# EAGLE design TL2285_labpcb (EAGLE 7.1.0)
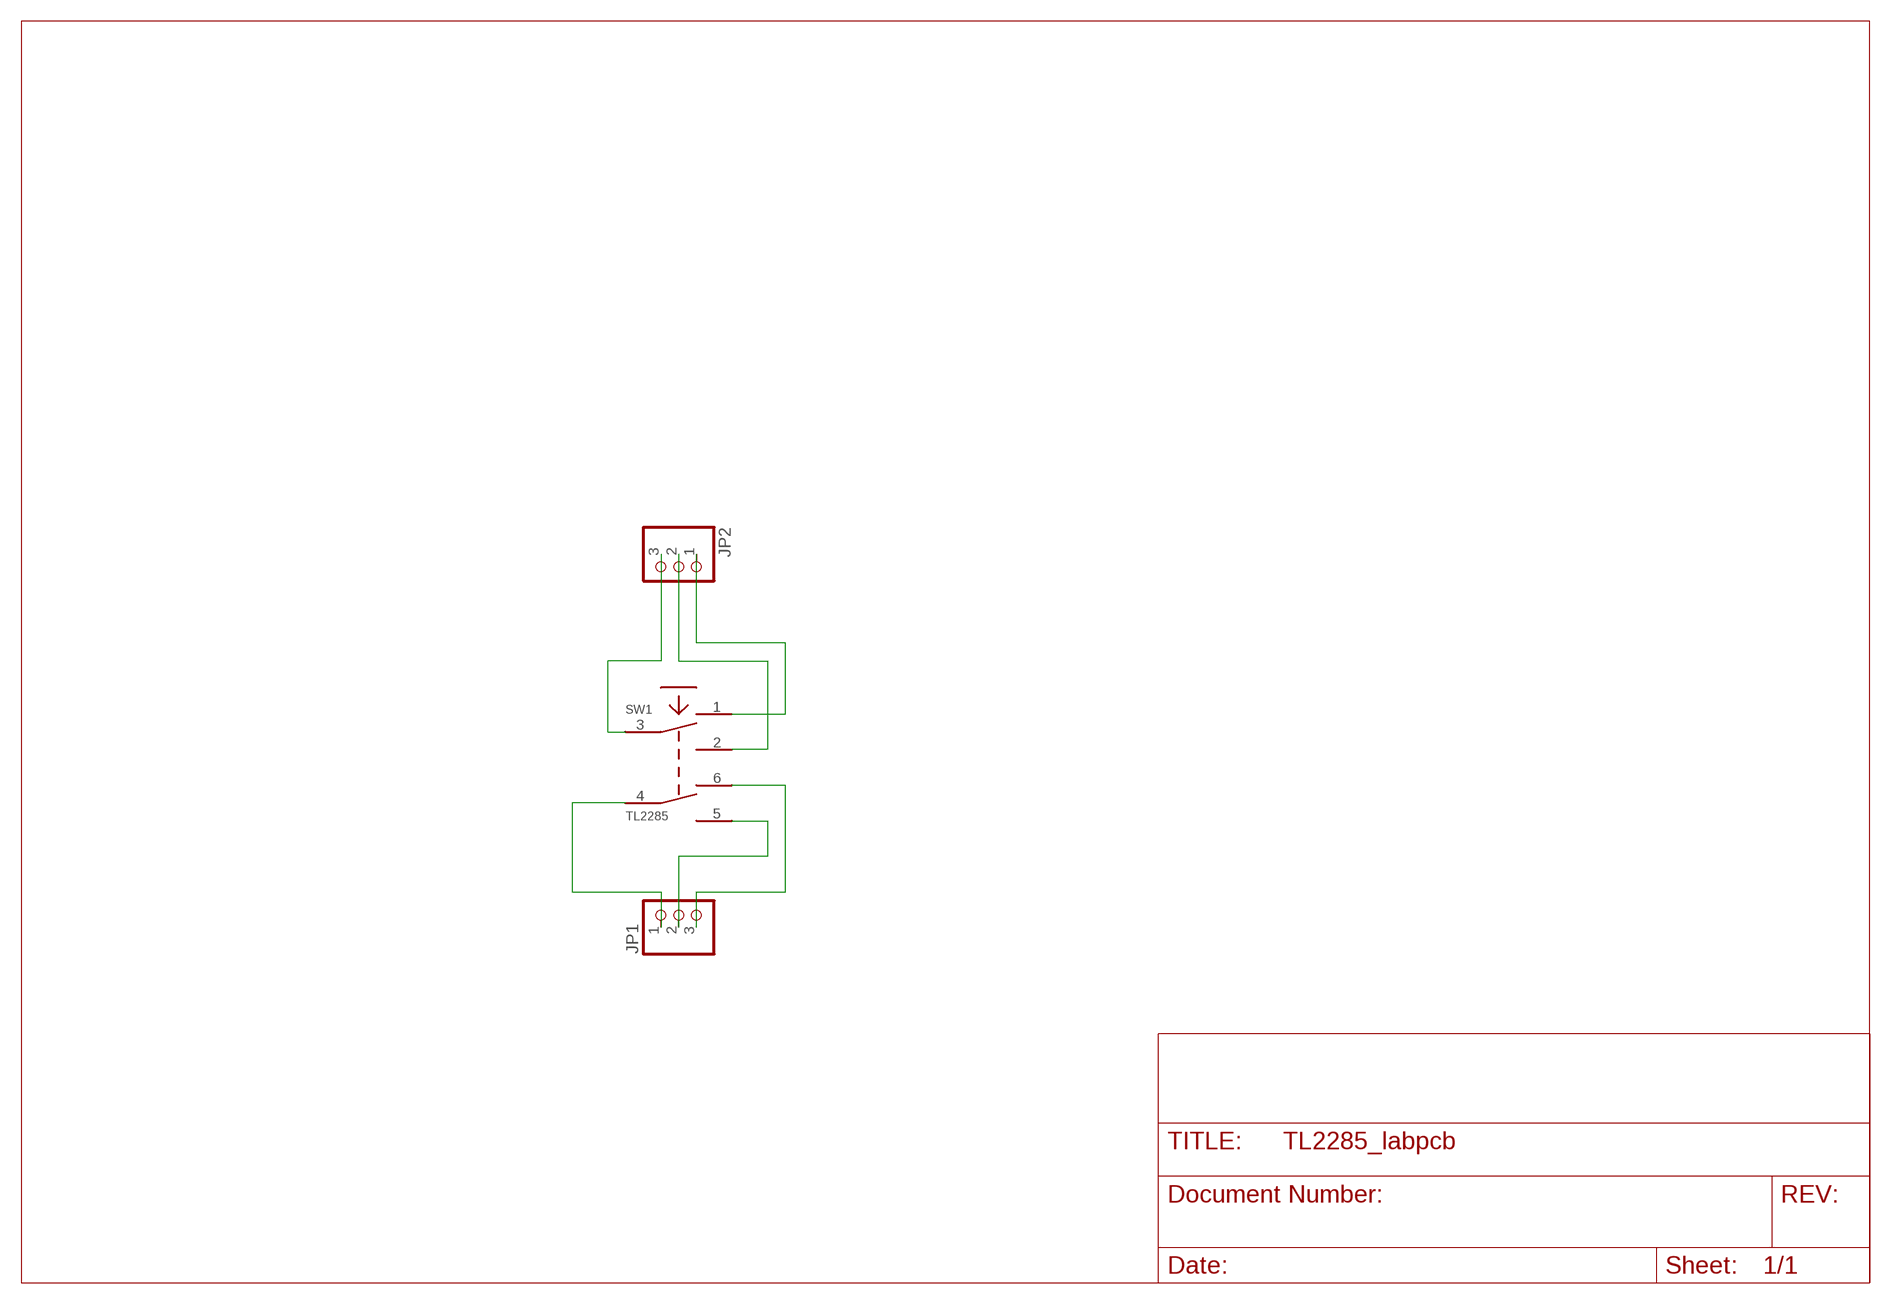
[diagram p0: schematic, sheet 1]

## Parts
JP1  PINHD-1X3  [1X03]
JP2  PINHD-1X3  [1X03]
SW1  TL2285  [TL2285_PCB]

## Nets
N$1: JP1.1 SW1.4
N$2: JP1.2 SW1.5
N$3: JP1.3 SW1.6
N$5: JP2.3 SW1.3
N$6: JP2.1 SW1.1
N$7: JP2.2 SW1.2

## Library data of the parts
JP1 JP2 = pinhead:PINHD-1X3: PIN HEADER
SW1 = lb_devs:TL2285: E-Switch TL2285 (PCB switch)

## Board
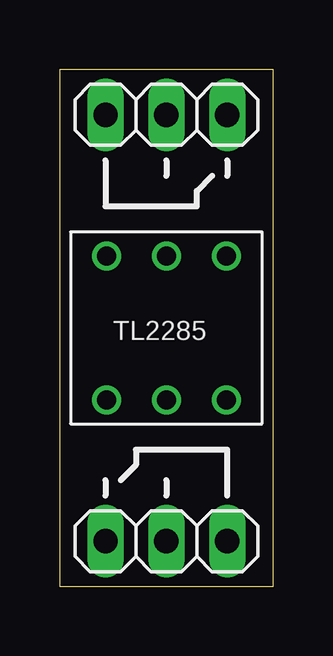
[diagram p1: board, top side]
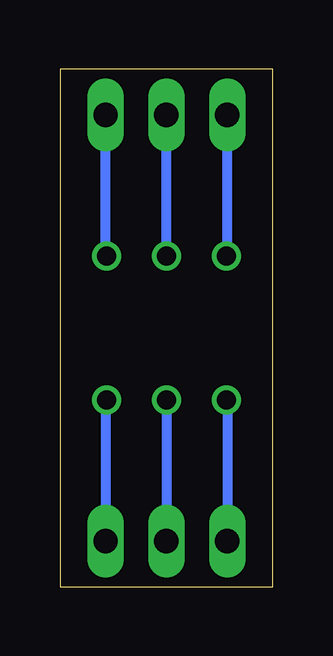
[diagram p2: board, bottom side, seen from below]

Size 8.89 x 21.59 mm. Coordinates in mm from the lower left corner, seen from the top.
Outline: 0,0 0,21.59 8.89,21.59 8.89,0 0,0
Copper layers (1*16): Top 0.0356mm / dielectric 1.5011mm / Bottom 0.0356mm
Design rules "LaenPCBOrder": minimum track width 6mil, minimum drill 13mil, track to track 6mil, track to pad 6mil, pad to pad 6mil, via to via 6mil, smd to smd 6mil, copper to edge 15mil, drill to drill 6mil, minimum pad ring 7mil, minimum via ring 7mil, stop-mask expansion 3mil, vias tented up to drill 0mil, thermal gap 10mil

### Footprints (pad centres in the part's own frame; a part is rotated, then mirrored left to right if it is on the bottom)
1X03 = drill 1.016 long: 1 -2.54,0; 2 0,0; 3 2.54,0
TL2285_PCB = drill 0.8: 1 -2.5,-3; 2 0,-3; 3 2.5,-3; 4 -2.5,3; 5 0,3; 6 2.5,3

### Placement (x,y rotation side)
JP1  4.45,19.68 0 top
JP2  4.45,1.91 0 top
SW1  4.45,10.79 0 top

### Tracks (layer width: path | path; a pad name or v marks a point on that pad's centre or on a via)
N$1
  Bottom 0.406: SW1.4 1.91,13.79 JP1.1
N$2
  Bottom 0.406: SW1.5 JP1.2
N$3
  Bottom 0.406: SW1.6 6.99,13.79 JP1.3
N$5
  Bottom 0.406: SW1.3 6.99,7.79 JP2.3
N$6
  Bottom 0.406: SW1.1 1.91,7.79 JP2.1
N$7
  Bottom 0.406: SW1.2 JP2.2